# Altium schematic sheet w32_dmx512-slaver_Schematic.SchDoc
size A3
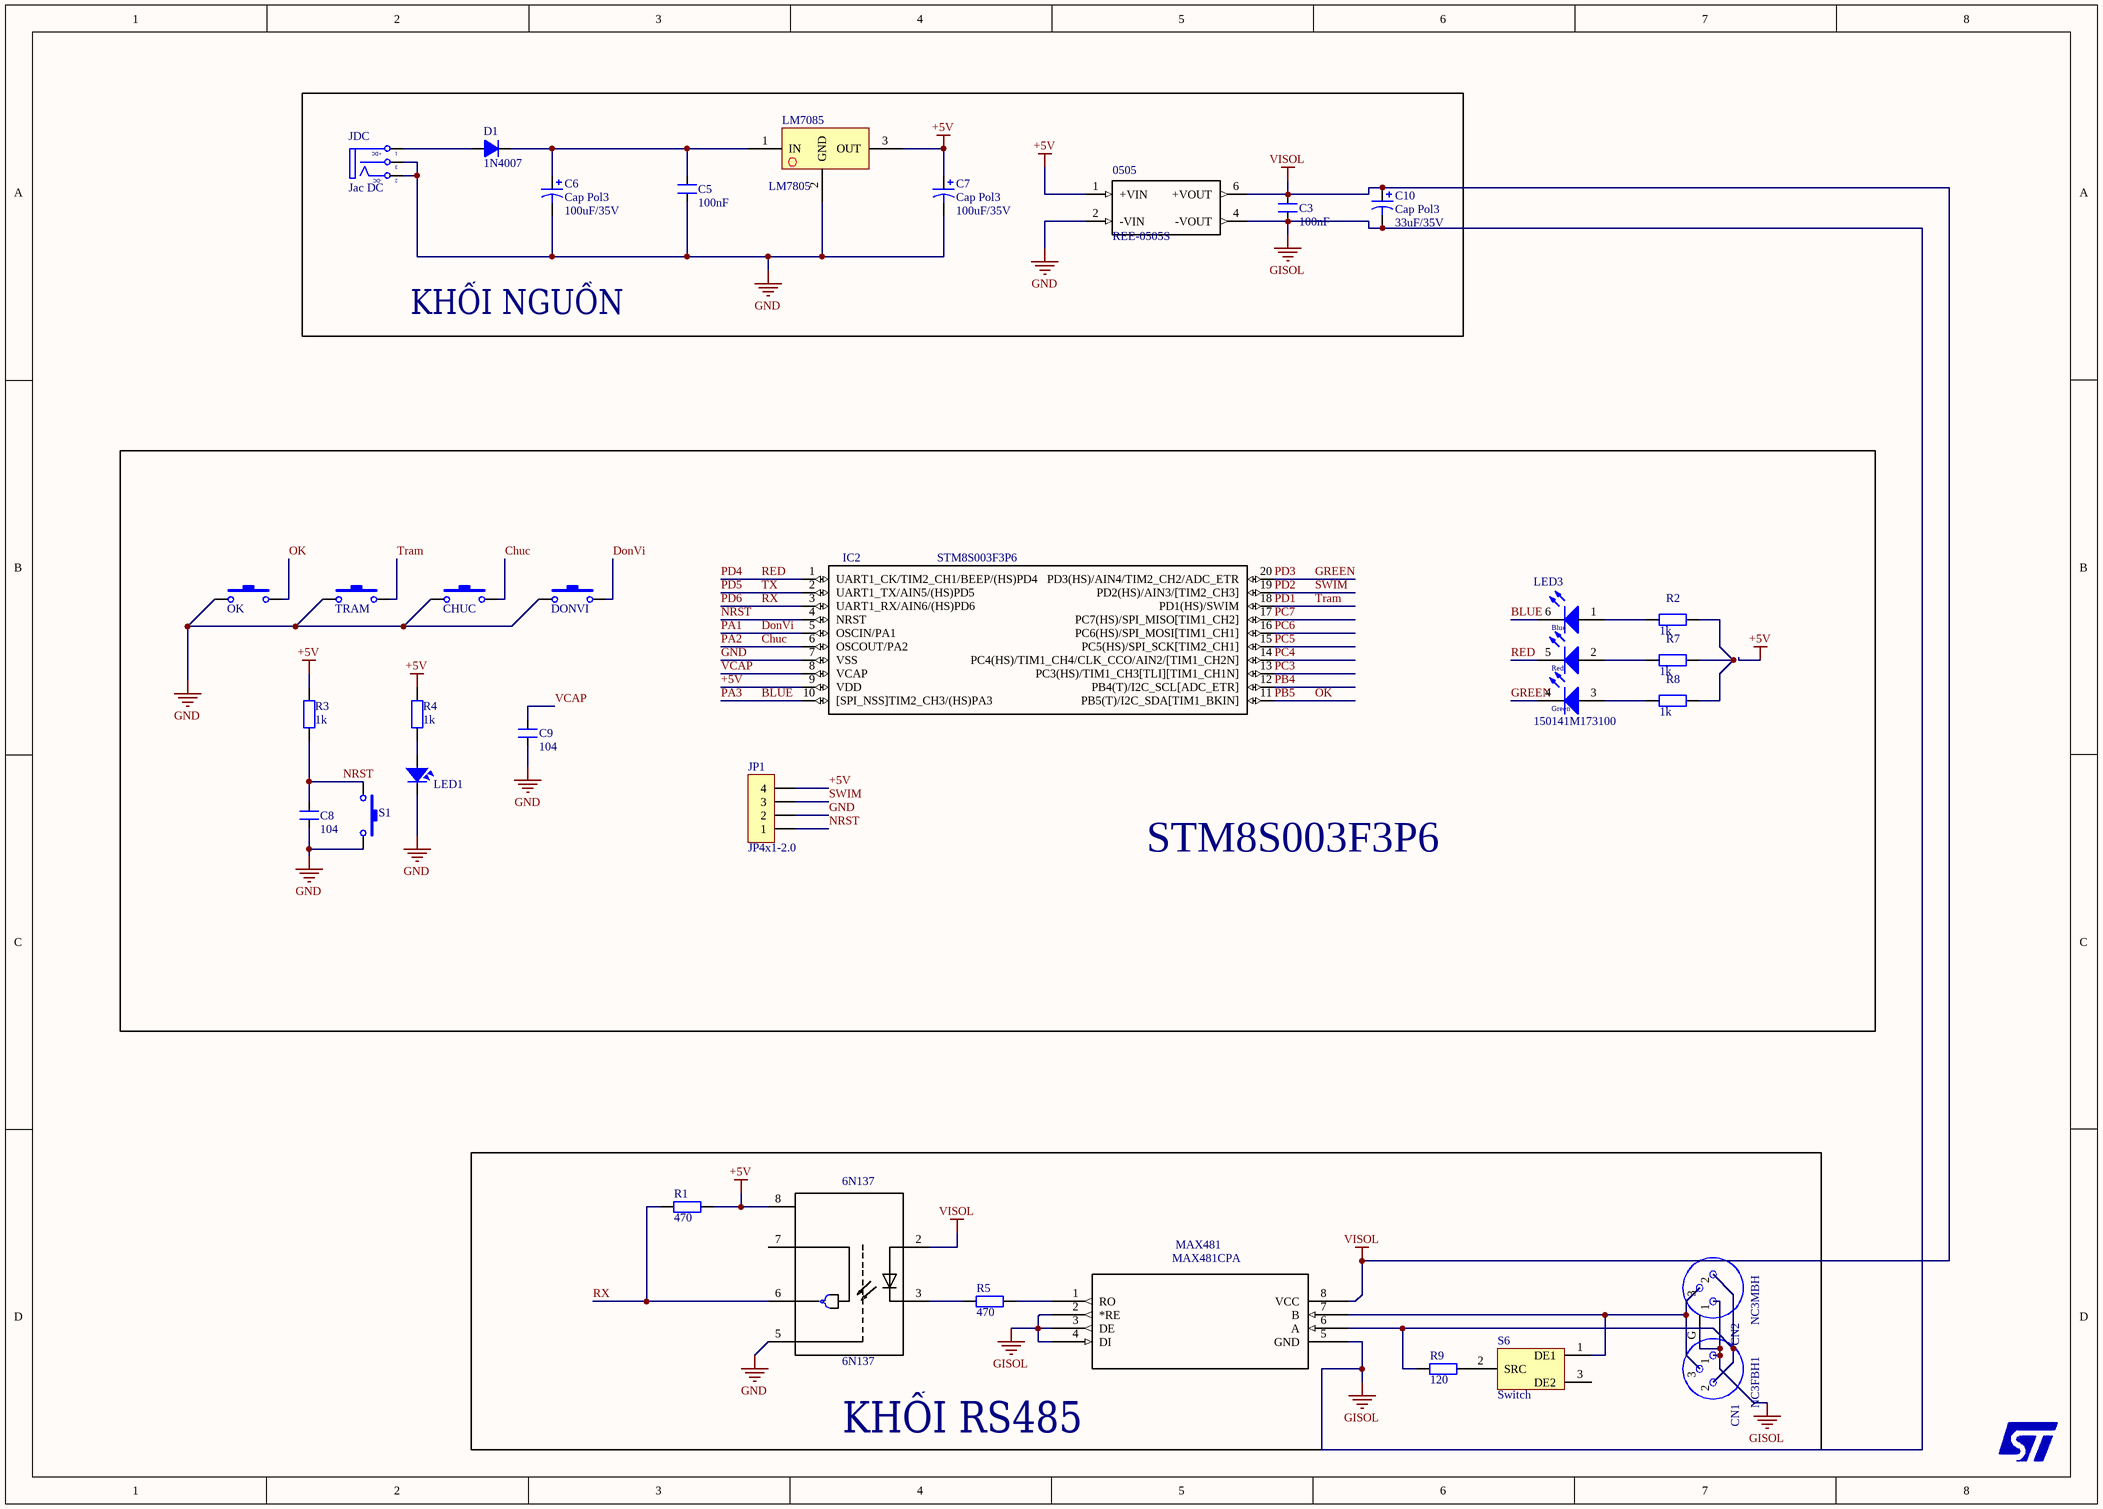
[diagram p0: w32_dmx512-slaver_Schematic.SchDoc]

## Parts
6N137  6N137  [DIP762W50P254L977H451Q8]
0505  REE-0505S  [SIP600W25P254L1960H1020Q4P]
C3  value 100nF  [CN150]  (hidden comment: 104)
C5  value 100nF  [CN150]  (hidden comment: 104)
C6  Cap Pol3  value 100uF/35V  [CP2/5]
C7  Cap Pol3  value 100uF/35V  [CP2/5]
C8  104  [CN150]
C9  104  [CN150]
C10  Cap Pol3  value 33uF/35V  [CP2/5]
CHUC  SW-SMD  [SW-SMD]  (value not drawn)
CN1  NC3FBH1  [NC3FBH1]
CN2  NC3MBH  [NC3MBH_NC3MBH(Primary)]
D1  1N4007  [D2A]
DONVI  SW-SMD  [SW-SMD]  (value not drawn)
IC2  STM8S003F3P6  [TSSOP20]
JDC  Jac DC  [DC-IN]
JP1  JP4x1-2.0  [J4-D1T]
LED1  LED  [LED-RED-0805]  (value not drawn)
LED3  150141M173100  [LED RGB 5050]
LM7085  LM7805  [7805]
M1  STLOGO  [STLOGO-SILVER]  (value not drawn)  (no BOM)
MAX481  MAX481CPA  [21-0043D_8]
OK  SW-SMD  [SW-SMD]  (value not drawn)
R1  value 470  [DIEN TRO 1/4 W]  (hidden comment: R0.4W)
R2  value 1k  [DIEN TRO 1/4 W]  (hidden comment: R0.4W)
R3  value 1k  [DIEN TRO 1/4 W]  (hidden comment: R0.4W)
R4  value 1k  [DIEN TRO 1/4 W]  (hidden comment: R0.4W)
R5  value 470  [DIEN TRO 1/4 W]  (hidden comment: R0.4W)
R7  value 1k  [DIEN TRO 1/4 W]  (hidden comment: R0.4W)
R8  value 1k  [DIEN TRO 1/4 W]  (hidden comment: R0.4W)
R9  value 120  [DIEN TRO 1/4 W]  (hidden comment: R0.4W)
S1  SW-SMD  [SW-SMD]  (value not drawn)
S6  Switch  [Switch]
TRAM  SW-SMD  [SW-SMD]  (value not drawn)

## Blocks framed on the sheet
KHỐI NGUỒN: 0505 C3 C5-C7 C10 D1 JDC LM7085
STM8S003F3P6: C8 C9 CHUC DONVI IC2 JP1 LED1 LED3 OK R2-R4 R7 R8 S1 TRAM
KHỐI RS485: 6N137 CN1 CN2 MAX481 R1 R5 R9 S6

## Nets
+5V: 6N137.8(VCC) 0505.1(+VIN) C7.1 IC2.9(VDD) JP1.4 LM7085.3(OUT) R1.2 R3.2 R4.2
GISOL: 0505.4(-VOUT) C3.1 C10.2 CN1.1 CN1.2 CN2.1 CN2.2 CN2.G MAX481.2(*RE) MAX481.3(DE) MAX481.4(DI) MAX481.5(GND) MAX481.6(A) R9.1
GND: 6N137.5(GND) 0505.2(-VIN) C5.1 C6.2 C7.2 C8.2 C9.1 CHUC.1 DONVI.1 IC2.7(VSS) JDC.2(TN) JDC.3(S) JP1.2 LED1.2 LM7085.2(GND) OK.1 S1.2 TRAM.1
VISOL: 6N137.2(A) 0505.6(+VOUT) C3.2 C10.1 MAX481.8(VCC)
BLUE: IC2.10([SPI_NSS]TIM2_CH3/(HS)PA3) LED3.6  [also labelled PA3]
Chuc: CHUC.2 IC2.6(OSCOUT/PA2)  [also labelled PA2]
DonVi: DONVI.2 IC2.5(OSCIN/PA1)  [also labelled PA1]
GREEN: IC2.20(PD3(HS)/AIN4/TIM2_CH2/ADC_ETR) LED3.4  [also labelled PD3]
NRST: C8.1 IC2.4(NRST) JP1.1 R3.1 S1.1
OK: IC2.11(PB5(T)/I2C_SDA[TIM1_BKIN]) OK.2  [also labelled PB5]
PB4: IC2.12(PB4(T)/I2C_SCL[ADC_ETR])
PC3: IC2.13(PC3(HS)/TIM1_CH3[TLI][TIM1_CH1N])
PC4: IC2.14(PC4(HS)/TIM1_CH4/CLK_CCO/AIN2/[TIM1_CH2N])
PC5: IC2.15(PC5(HS)/SPI_SCK[TIM2_CH1])
PC6: IC2.16(PC6(HS)/SPI_MOSI[TIM1_CH1])
PC7: IC2.17(PC7(HS)/SPI_MISO[TIM1_CH2])
PD1: IC2.18(PD1(HS)/SWIM) TRAM.2  [also labelled Tram]
PD2: IC2.19(PD2(HS)/AIN3/[TIM2_CH3]) JP1.3  [also labelled SWIM]
PD4: IC2.1(UART1_CK/TIM2_CH1/BEEP/(HS)PD4) LED3.5  [also labelled RED]
PD5: IC2.2(UART1_TX/AIN5/(HS)PD5)  [also labelled TX]
PD6: 6N137.6(VO) IC2.3(UART1_RX/AIN6/(HS)PD6) R1.1  [also labelled RX]
VCAP: C9.2 IC2.8(VCAP)
Net6N137_3: 6N137.3(C) R5.1
NetC5_2: C5.2 C6.1 D1.2(K) LM7085.1(IN)
NetCN1_3: CN1.3 CN2.3 MAX481.7(B) S6.1(DE1)
NetD1_1: D1.1(A) JDC.1(T)
NetLED1_1: LED1.1 R4.1
NetLED3_1: LED3.1 R2.1
NetLED3_2: LED3.2 R7.1
NetLED3_3: LED3.3 R8.1
NetMAX481_1: MAX481.1(RO) R5.2
NetR2_2: R2.2 R7.2 R8.2
NetR9_2: R9.2 S6.2(SRC)

Not connected (* = marked no-connect by the designer): 6N137 7(VE); S6 3(DE2) 4 5

## Notes on the sheet
- (in symbol DCIN) +DC; -DC
- (in symbol LED RGB 5050) Blue; Red; Green

## Library data of the parts
6N137 = 6N137: High CMR, High Speed TTL Compatible Optocouplers; MF: Vishay Semiconductor; SnapEDA_Link: https://www.snapeda.com/symbols-footprints/6N137/Vishay%20Semiconductor%20Opto%20Division/view-part/?ref=snap; Price: 1.38 USD; MP: 6N137; Package: DIP-8 Broadcom; Availability: Warning; Value: *
0505 = REE-0505S: REE Series 4.5 - 5.5 V 1 W Single Output Through Hole DC/DC-Converter - SIP7; MF: Recom Power; Package: SIP-6 Recom Power; Price: 2.48 USD; MP: REE-0505S; Availability: Good; SnapEDA_Link: https://www.snapeda.com/symbols-footprints/REE-0505S/Recom%20Power/view-part/?ref=snap; Value: *
C3 C5 C8 C9 = CN1.5: Capacitor Ceramic
  C8 C9: Value: 104
C6 C7 C10 = Cap Pol3: Polarized Capacitor (Surface Mount); VALUE: C?; LatestRevisionDate: 17-Jul-2002; LatestRevisionNote: Re-released for DXP Platform.; PackageReference: C0805; Publisher: Altium Limited
CHUC DONVI OK S1 TRAM = SW-SMD: Switch; Published: 24-Mar-1999; LatestRevisionDate: 17-Jul-2002; LatestRevisionNote: Re-released for DXP Platform.; PackageReference: SPST-2; Publisher: Altium Limited
CN1 = NC3FBH1: XLR Receptacle; Female; Gold; Horizontal PCB Mount; 0.996 in.; Ground; MF: Neutrik; Price: 2.36 USD; SnapEDA_Link: https://www.snapeda.com/symbols-footprints/NC3FBH1/Neutrik/view-part/?ref=snap; MP: NC3FBH1; Availability: Good; Package: None; Value: *
CN2 = NC3MBH: Conn XLR Connector Adapter M 3 POS Solder RA Thru-Hole 3 Terminal 1 Port; MF: Neutrik; SnapEDA_Link: https://www.snapeda.com/symbols-footprints/NC3MBH/Neutrik/view-part/?ref=snap; Price: 2.21 USD; MP: NC3MBH; Package: None; Availability: Good; Value: *
D1 = D1A: Diode 1A; Value: 1N4007
IC2 = STM8S003F3P6: Mainstream Value line 8-bit MCU with 8 Kbytes Flash, 16 MHz CPU, integrated EEPROM; MF: STMicroelectronics; Package: TSSOP-20 STMicroelectronics; Price: 0.58 USD; MP: STM8S003F3P6; SnapEDA_Link: https://www.snapeda.com/symbols-footprints/STM8S003F3P6/STMicroelectronics/view-part/?ref=snap; Availability: Bad; Value: *
JDC = DCIN: Jac DC input; Value: Jac DC
JP1 = JP4x1-2.0: WR-PHD 2.00 mm Socket Header; Manufacturer: W¨¹rth Elektronik eiSos GmbH; partNo: 62000411821; ComponentLink1 Description: Manufacturer; ComponentLink2 Description: Datasheet; NoPins: 04; Created Date: 2 April 2013; ComponentLink1URL: http://www.we-online.com; ComponentLink2URL: http://katalog.we-online.de/em/datasheet/6200xx11821.pdf; Created by: Karrer Zheng
LED1 = LED SMD: Value: LED 3 - 5 ly 2 Colour
LED3 = LED RGB 5050: Manufacturer: Würth Elektronik eiSos GmbH; Color: Red & Green & Blue; PartNo: 150141M173100; ComponentLink1Description: Manufacturer; ComponentLink1URL: http://www.we-online.de; Created by: Christin Otto; Created Date: June 2013; ComponentLink2Description: Datasheet; ComponentLink2URL: http://katalog.we-online.com/led/datasheet/150141M173100.pdf
MAX481 = MAX481CPA: Single Transmitter/Receiver RS-422/RS-485 8-Pin PDIP N; MF: Maxim Integrated; MP: MAX481CPA; SnapEDA_Link: https://www.snapeda.com/symbols-footprints/MAX481CPA/Maxim%20Integrated/view-part/?ref=snap; Price: 1.85 USD; Availability: Warning; Package: DIP-8 Maxim Integrated; Value: *
R1-R5 R7-R9 = Res 1/4 W: Resistor; Published: 8-Jun-2000; LatestRevisionDate: 17-Jul-2002; LatestRevisionNote: Re-released for DXP Platform.; PackageReference: AXIAL-0.4; Publisher: Altium Limited